# EAGLE design Nova V1.0 (EAGLE 9.6.2)
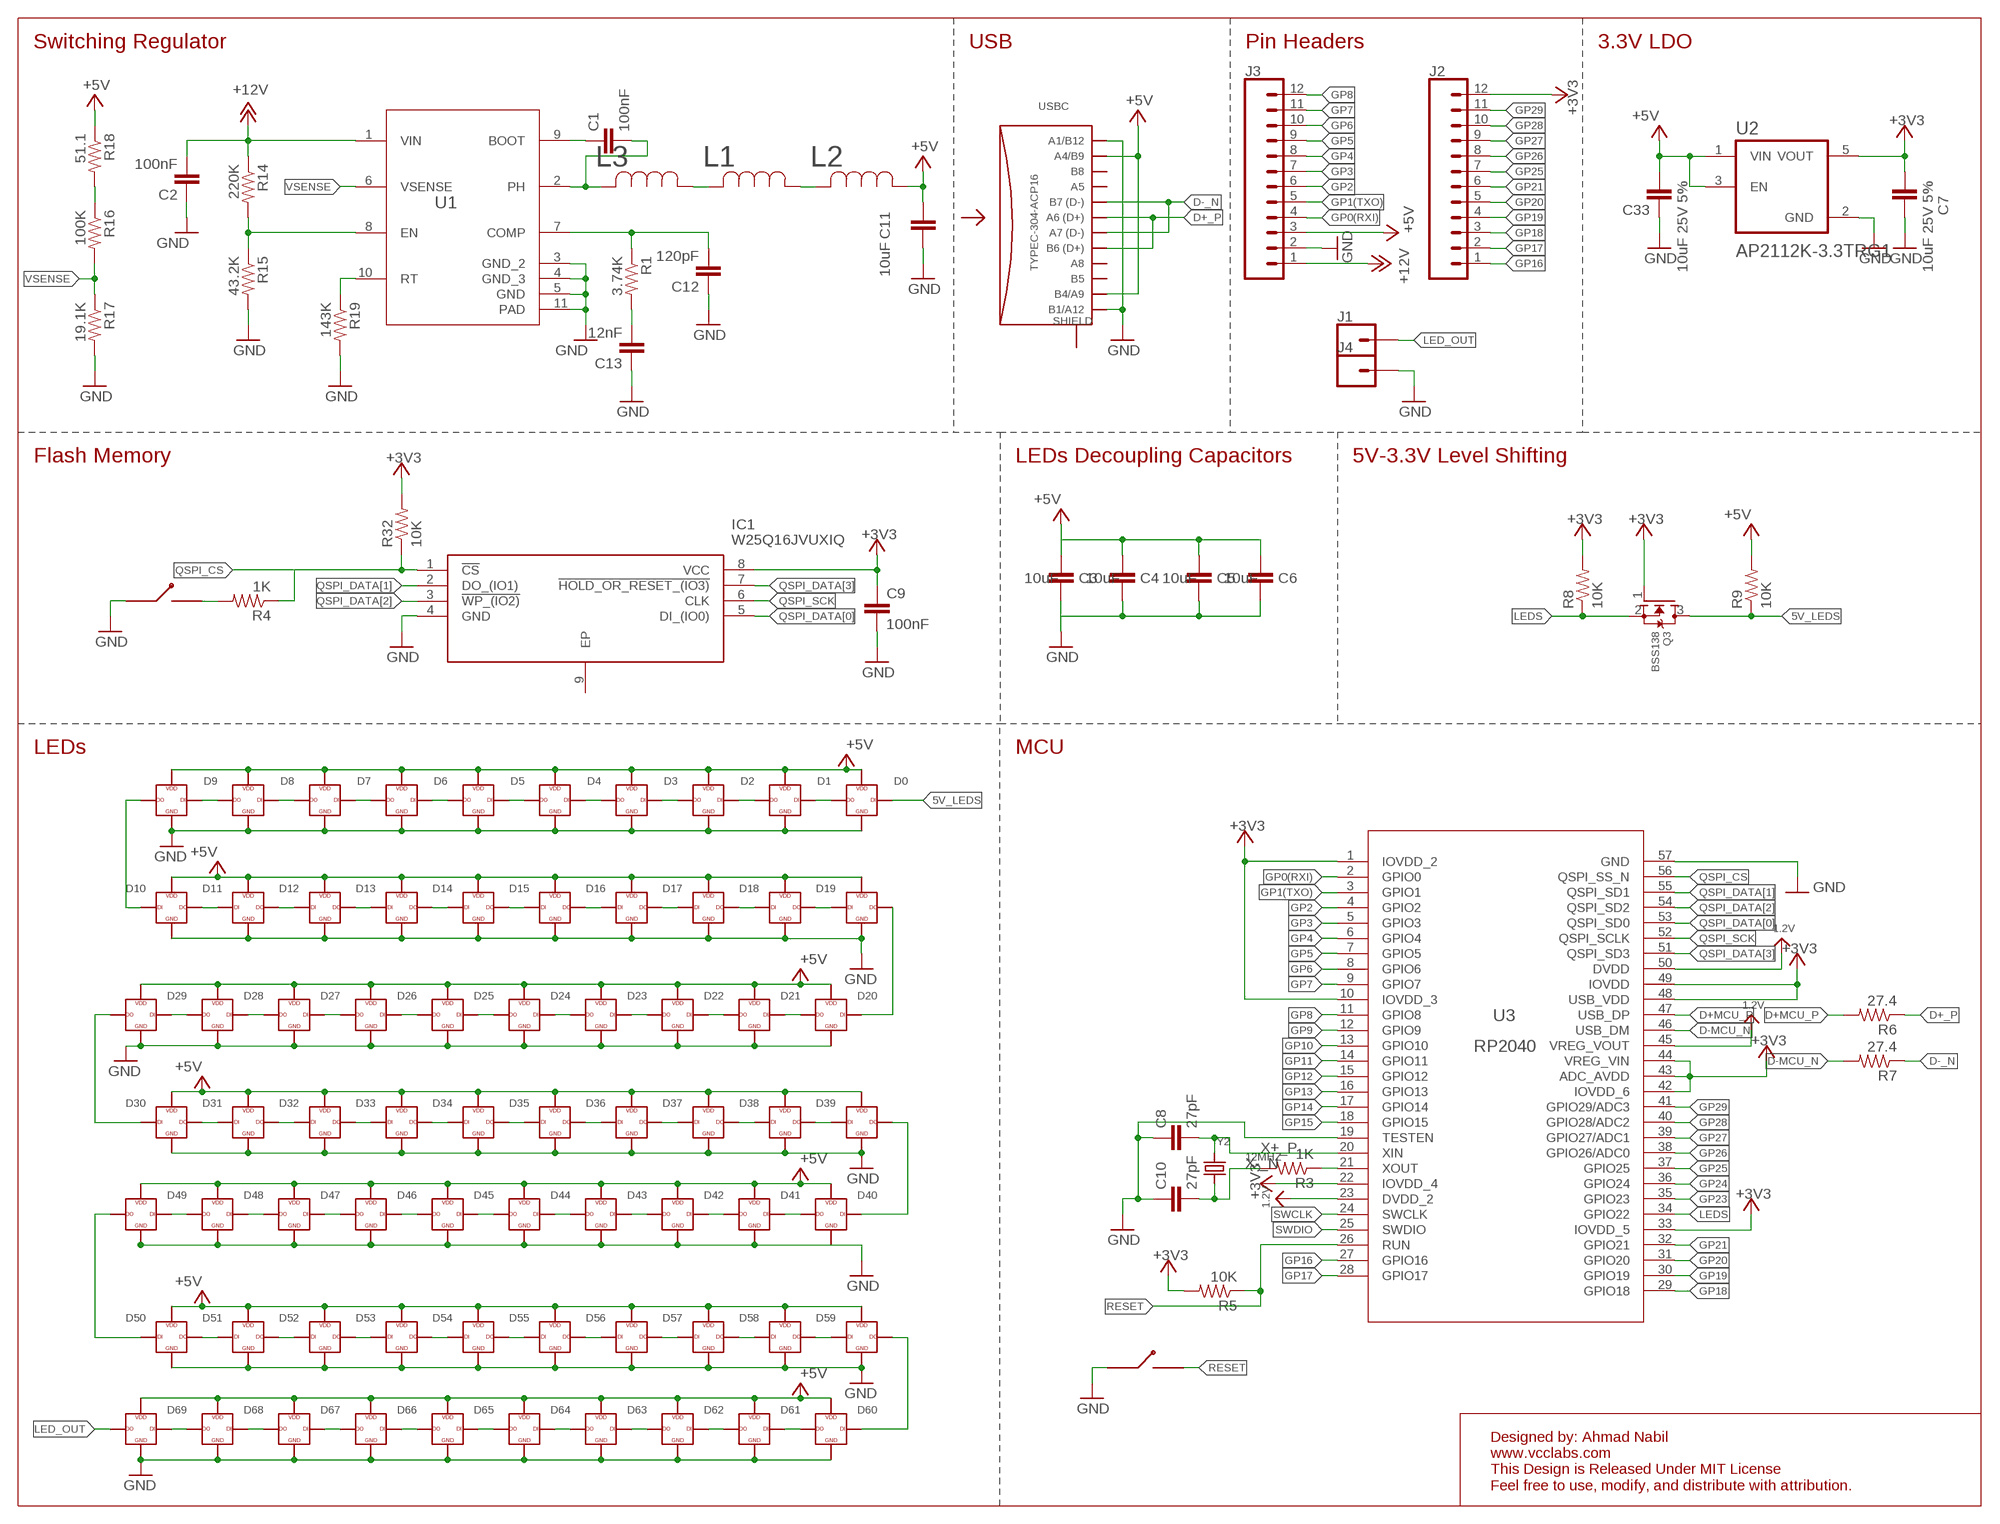
[diagram p0: schematic, sheet 1]

## Parts
C1  100nF  CAP-0402-TIGHT  [0402-TIGHT]
C2  100nF  CAP-0402-TIGHT  [0402-TIGHT]
C3  10uF  C-EUC0603  [C0603]
C4  10uF  C-EUC0603  [C0603]
C5  10uF  C-EUC0603  [C0603]
C6  10uF  C-EUC0603  [C0603]
C7  10uF 25V 5%  C-EUC0603  [C0603]
C8  27pF  CAP-0402-TIGHT  [0402-TIGHT]
C9  100nF  CAP-0402-TIGHT  [0402-TIGHT]
C10  27pF  CAP-0402-TIGHT  [0402-TIGHT]
C11  10uF  C-EUC0603  [C0603]
C12  120pF  CAP-0402-TIGHT  [0402-TIGHT]
C13  12nF  CAP-0402-TIGHT  [0402-TIGHT]
C33  10uF 25V 5%  C-EUC0603  [C0603]
D0  XL-1010RGBC-WS2812B  [XL-1010RGBC-WS2812B]
D1  XL-1010RGBC-WS2812B  [XL-1010RGBC-WS2812B]
D2  XL-1010RGBC-WS2812B  [XL-1010RGBC-WS2812B]
D3  XL-1010RGBC-WS2812B  [XL-1010RGBC-WS2812B]
D4  XL-1010RGBC-WS2812B  [XL-1010RGBC-WS2812B]
D5  XL-1010RGBC-WS2812B  [XL-1010RGBC-WS2812B]
D6  XL-1010RGBC-WS2812B  [XL-1010RGBC-WS2812B]
D7  XL-1010RGBC-WS2812B  [XL-1010RGBC-WS2812B]
D8  XL-1010RGBC-WS2812B  [XL-1010RGBC-WS2812B]
D9  XL-1010RGBC-WS2812B  [XL-1010RGBC-WS2812B]
D10  XL-1010RGBC-WS2812B  [XL-1010RGBC-WS2812B]
D11  XL-1010RGBC-WS2812B  [XL-1010RGBC-WS2812B]
D12  XL-1010RGBC-WS2812B  [XL-1010RGBC-WS2812B]
D13  XL-1010RGBC-WS2812B  [XL-1010RGBC-WS2812B]
D14  XL-1010RGBC-WS2812B  [XL-1010RGBC-WS2812B]
D15  XL-1010RGBC-WS2812B  [XL-1010RGBC-WS2812B]
D16  XL-1010RGBC-WS2812B  [XL-1010RGBC-WS2812B]
D17  XL-1010RGBC-WS2812B  [XL-1010RGBC-WS2812B]
D18  XL-1010RGBC-WS2812B  [XL-1010RGBC-WS2812B]
D19  XL-1010RGBC-WS2812B  [XL-1010RGBC-WS2812B]
D20  XL-1010RGBC-WS2812B  [XL-1010RGBC-WS2812B]
D21  XL-1010RGBC-WS2812B  [XL-1010RGBC-WS2812B]
D22  XL-1010RGBC-WS2812B  [XL-1010RGBC-WS2812B]
D23  XL-1010RGBC-WS2812B  [XL-1010RGBC-WS2812B]
D24  XL-1010RGBC-WS2812B  [XL-1010RGBC-WS2812B]
D25  XL-1010RGBC-WS2812B  [XL-1010RGBC-WS2812B]
D26  XL-1010RGBC-WS2812B  [XL-1010RGBC-WS2812B]
D27  XL-1010RGBC-WS2812B  [XL-1010RGBC-WS2812B]
D28  XL-1010RGBC-WS2812B  [XL-1010RGBC-WS2812B]
D29  XL-1010RGBC-WS2812B  [XL-1010RGBC-WS2812B]
D30  XL-1010RGBC-WS2812B  [XL-1010RGBC-WS2812B]
D31  XL-1010RGBC-WS2812B  [XL-1010RGBC-WS2812B]
D32  XL-1010RGBC-WS2812B  [XL-1010RGBC-WS2812B]
D33  XL-1010RGBC-WS2812B  [XL-1010RGBC-WS2812B]
D34  XL-1010RGBC-WS2812B  [XL-1010RGBC-WS2812B]
D35  XL-1010RGBC-WS2812B  [XL-1010RGBC-WS2812B]
D36  XL-1010RGBC-WS2812B  [XL-1010RGBC-WS2812B]
D37  XL-1010RGBC-WS2812B  [XL-1010RGBC-WS2812B]
D38  XL-1010RGBC-WS2812B  [XL-1010RGBC-WS2812B]
D39  XL-1010RGBC-WS2812B  [XL-1010RGBC-WS2812B]
D40  XL-1010RGBC-WS2812B  [XL-1010RGBC-WS2812B]
D41  XL-1010RGBC-WS2812B  [XL-1010RGBC-WS2812B]
D42  XL-1010RGBC-WS2812B  [XL-1010RGBC-WS2812B]
D43  XL-1010RGBC-WS2812B  [XL-1010RGBC-WS2812B]
D44  XL-1010RGBC-WS2812B  [XL-1010RGBC-WS2812B]
D45  XL-1010RGBC-WS2812B  [XL-1010RGBC-WS2812B]
D46  XL-1010RGBC-WS2812B  [XL-1010RGBC-WS2812B]
D47  XL-1010RGBC-WS2812B  [XL-1010RGBC-WS2812B]
D48  XL-1010RGBC-WS2812B  [XL-1010RGBC-WS2812B]
D49  XL-1010RGBC-WS2812B  [XL-1010RGBC-WS2812B]
D50  XL-1010RGBC-WS2812B  [XL-1010RGBC-WS2812B]
D51  XL-1010RGBC-WS2812B  [XL-1010RGBC-WS2812B]
D52  XL-1010RGBC-WS2812B  [XL-1010RGBC-WS2812B]
D53  XL-1010RGBC-WS2812B  [XL-1010RGBC-WS2812B]
D54  XL-1010RGBC-WS2812B  [XL-1010RGBC-WS2812B]
D55  XL-1010RGBC-WS2812B  [XL-1010RGBC-WS2812B]
D56  XL-1010RGBC-WS2812B  [XL-1010RGBC-WS2812B]
D57  XL-1010RGBC-WS2812B  [XL-1010RGBC-WS2812B]
D58  XL-1010RGBC-WS2812B  [XL-1010RGBC-WS2812B]
D59  XL-1010RGBC-WS2812B  [XL-1010RGBC-WS2812B]
D60  XL-1010RGBC-WS2812B  [XL-1010RGBC-WS2812B]
D61  XL-1010RGBC-WS2812B  [XL-1010RGBC-WS2812B]
D62  XL-1010RGBC-WS2812B  [XL-1010RGBC-WS2812B]
D63  XL-1010RGBC-WS2812B  [XL-1010RGBC-WS2812B]
D64  XL-1010RGBC-WS2812B  [XL-1010RGBC-WS2812B]
D65  XL-1010RGBC-WS2812B  [XL-1010RGBC-WS2812B]
D66  XL-1010RGBC-WS2812B  [XL-1010RGBC-WS2812B]
D67  XL-1010RGBC-WS2812B  [XL-1010RGBC-WS2812B]
D68  XL-1010RGBC-WS2812B  [XL-1010RGBC-WS2812B]
D69  XL-1010RGBC-WS2812B  [XL-1010RGBC-WS2812B]
IC1  W25Q16JVUXIQ  [SON50P300X200X60-9N]
J1  CONN_01  [1X01]
J2  CONN_12  [1X12]
J3  CONN_12  [1X12]
J4  CONN_01  [1X01]
L1  MLP2520S4R7MT0S1IND_2520_TDK-L  [IND_2520_TDK-L]
L2  MLP2520S4R7MT0S1IND_2520_TDK-L  [IND_2520_TDK-L]
L3  MLP2520S4R7MT0S1IND_2520_TDK-L  [IND_2520_TDK-L]
Q3  BSS138  MOSFET-NREFLOW  [SOT23]
R1  3.74K  R-US_R0402  [R0402]
R3  1K  R-US_R0402  [R0402]
R4  1K  R-US_R0402  [R0402]
R5  10K  R-US_R0402  [R0402]
R6  27.4  R-US_R0402  [R0402]
R7  27.4  R-US_R0402  [R0402]
R8  10K  R-US_R0402  [R0402]
R9  10K  R-US_R0402  [R0402]
R14  220K  R-US_R0402  [R0402]
R15  43.2K  R-US_R0402  [R0402]
R16  100K  R-US_R0402  [R0402]
R17  19.1K  R-US_R0402  [R0402]
R18  51.1  R-US_R0402  [R0402]
R19  143K  R-US_R0402  [R0402]
R32  10K  R-US_R0402  [R0402]
S1  B3U-1000P  [B3U-1000P]
S2  B3U-1000P  [B3U-1000P]
U1  TPS54335ADRCRDRC0010J_NV  [DRC0010J_NV]
U2  AP2112K-3.3TRG1  [SOT95P285X140-5N]
U3  RP2040  [IC57_RP2040]
USBC  TYPEC-304-ACP16  [TYPEC-304-ACP16]
Y2  12MHZ  CRYSTAL2.5X2.0  [CRYSTAL_2.5X2]

## Nets
1.2V: U3.23(DVDD_2) U3.45(VREG_VOUT) U3.50(DVDD)
5V_LEDS: D0.4 Q3.3(D) R9.1
+3V3: C7.2 C9.1 IC1.8(VCC) J2.12 Q3.1(G) R5.2 R8.2 R32.2 U2.5(VOUT) U3.1(IOVDD_2) U3.10(IOVDD_3) U3.22(IOVDD_4) U3.33(IOVDD_5) U3.42(IOVDD_6) U3.43(ADC_AVDD) U3.44(VREG_VIN) U3.48(USB_VDD) U3.49(IOVDD)
+5V: C3.1 C4.1 C5.1 C6.1 C11.2 C33.2 D0.2 D1.2 D2.2 D3.2 D4.2 D5.2 D6.2 D7.2 D8.2 D9.2 D10.2 D11.2 D12.2 D13.2 D14.2 D15.2 D16.2 D17.2 D18.2 D19.2 D20.2 D21.2 D22.2 D23.2 D24.2 D25.2 D26.2 D27.2 D28.2 D29.2 D30.2 D31.2 D32.2 D33.2 D34.2 D35.2 D36.2 D37.2 D38.2 D39.2 D40.2 D41.2 D42.2 D43.2 D44.2 D45.2 D46.2 D47.2 D48.2 D49.2 D50.2 D51.2 D52.2 D53.2 D54.2 D55.2 D56.2 D57.2 D58.2 D59.2 D60.2 D61.2 D62.2 D63.2 D64.2 D65.2 D66.2 D67.2 D68.2 D69.2 J3.3 L2.1 R9.2 R18.1 U2.1(VIN) U2.3(EN) USBC.A4/B9 USBC.B4/A9
+12V [power]: C2.2 J3.1 R14.1 U1.1(VIN)
D+_P: R6.1 USBC.A6 USBC.B6
D+MCU_P: R6.2 U3.47(USB_DP)
D-_N: R7.1 USBC.A7 USBC.B7
D-MCU_N: R7.2 U3.46(USB_DM)
GND: C2.1 C3.2 C4.2 C5.2 C6.2 C7.1 C8.1 C9.2 C10.1 C11.1 C12.1 C13.1 C33.1 D0.3 D1.3 D2.3 D3.3 D4.3 D5.3 D6.3 D7.3 D8.3 D9.3 D10.3 D11.3 D12.3 D13.3 D14.3 D15.3 D16.3 D17.3 D18.3 D19.3 D20.3 D21.3 D22.3 D23.3 D24.3 D25.3 D26.3 D27.3 D28.3 D29.3 D30.3 D31.3 D32.3 D33.3 D34.3 D35.3 D36.3 D37.3 D38.3 D39.3 D40.3 D41.3 D42.3 D43.3 D44.3 D45.3 D46.3 D47.3 D48.3 D49.3 D50.3 D51.3 D52.3 D53.3 D54.3 D55.3 D56.3 D57.3 D58.3 D59.3 D60.3 D61.3 D62.3 D63.3 D64.3 D65.3 D66.3 D67.3 D68.3 D69.3 IC1.4(GND) J3.2 J4.1 R15.2 R17.2 R19.2 S1.1 S2.1 U1.3(GND_2) U1.4(GND_3) U1.5(GND) U1.11(PAD) U2.2(GND) U3.19(TESTEN) U3.57(GND) USBC.A1/B12 USBC.B1/A12
GP0(RXI): J3.4 U3.2(GPIO0)
GP1(TXO): J3.5 U3.3(GPIO1)
GP2: J3.6 U3.4(GPIO2)
GP3: J3.7 U3.5(GPIO3)
GP4: J3.8 U3.6(GPIO4)
GP5: J3.9 U3.7(GPIO5)
GP6: J3.10 U3.8(GPIO6)
GP7: J3.11 U3.9(GPIO7)
GP8: J3.12 U3.11(GPIO8)
GP9: U3.12(GPIO9)
GP10: U3.13(GPIO10)
GP11: U3.14(GPIO11)
GP12: U3.15(GPIO12)
GP13: U3.16(GPIO13)
GP14: U3.17(GPIO14)
GP15: U3.18(GPIO15)
GP16: J2.1 U3.27(GPIO16)
GP17: J2.2 U3.28(GPIO17)
GP18: J2.3 U3.29(GPIO18)
GP19: J2.4 U3.30(GPIO19)
GP20: J2.5 U3.31(GPIO20)
GP21: J2.6 U3.32(GPIO21)
GP23: U3.35(GPIO23)
GP24: U3.36(GPIO24)
GP25: J2.7 U3.37(GPIO25)
GP26: J2.8 U3.38(GPIO26/ADC0)
GP27: J2.9 U3.39(GPIO27/ADC1)
GP28: J2.10 U3.40(GPIO28/ADC2)
GP29: J2.11 U3.41(GPIO29/ADC3)
LED_OUT: D69.1 J1.1
LEDS: Q3.2(S) R8.1 U3.34(GPIO22)
N$1: D0.1 D1.4
N$2: D1.1 D2.4
N$3: D2.1 D3.4
N$4: D3.1 D4.4
N$5: D4.1 D5.4
N$6: D5.1 D6.4
N$7: D6.1 D7.4
N$8: D7.1 D8.4
N$9: D8.1 D9.4
N$10: D9.1 D10.4
N$11: D10.1 D11.4
N$12: D11.1 D12.4
N$13: D12.1 D13.4
N$14: D13.1 D14.4
N$15: D14.1 D15.4
N$16: D15.1 D16.4
N$17: D16.1 D17.4
N$18: D17.1 D18.4
N$19: D18.1 D19.4
N$20: D19.1 D20.4
N$21: D20.1 D21.4
N$22: D21.1 D22.4
N$23: D22.1 D23.4
N$24: D23.1 D24.4
N$25: D24.1 D25.4
N$26: D25.1 D26.4
N$27: D26.1 D27.4
N$28: D27.1 D28.4
N$29: D28.1 D29.4
N$30: D29.1 D30.4
N$31: D30.1 D31.4
N$32: D31.1 D32.4
N$33: D32.1 D33.4
N$34: D33.1 D34.4
N$35: D34.1 D35.4
N$36: D35.1 D36.4
N$37: D36.1 D37.4
N$38: D37.1 D38.4
N$39: D38.1 D39.4
N$40: D39.1 D40.4
N$41: D40.1 D41.4
N$42: D41.1 D42.4
N$43: D42.1 D43.4
N$44: D43.1 D44.4
N$45: D44.1 D45.4
N$46: D45.1 D46.4
N$47: D46.1 D47.4
N$48: D47.1 D48.4
N$49: D48.1 D49.4
N$50: D49.1 D50.4
N$51: D50.1 D51.4
N$52: D51.1 D52.4
N$53: D52.1 D53.4
N$54: D53.1 D54.4
N$55: D54.1 D55.4
N$56: D55.1 D56.4
N$57: D56.1 D57.4
N$58: D57.1 D58.4
N$59: D58.1 D59.4
N$60: D59.1 D60.4
N$61: D60.1 D61.4
N$62: D61.1 D62.4
N$63: D62.1 D63.4
N$64: D63.1 D64.4
N$65: D64.1 D65.4
N$66: D65.1 D66.4
N$67: D66.1 D67.4
N$68: D67.1 D68.4
N$69: D68.1 D69.4
N$70: R3.1 U3.21(XOUT)
N$71: R4.2 S1.2
N$79: C1.1 U1.9(BOOT)
N$80 [power]: L1.2 L3.1
N$81 [power]: L1.1 L2.2
N$82: C13.2 R1.2
N$83: C12.2 R1.1 U1.7(COMP)
N$84: R14.2 R15.1 U1.8(EN)
N$85: R16.1 R18.2
N$86: R19.1 U1.10(RT)
PH [power]: C1.2 L3.2 U1.2(PH)
QSPI_CS: IC1.1(!CS) R4.1 R32.1 U3.56(QSPI_SS_N)
QSPI_DATA[0]: IC1.5(DI_(IO0)) U3.53(QSPI_SD0)
QSPI_DATA[1]: IC1.2(DO_(IO1)) U3.55(QSPI_SD1)
QSPI_DATA[2]: IC1.3(!WP_(IO2)) U3.54(QSPI_SD2)
QSPI_DATA[3]: IC1.7(!HOLD_OR_RESET_(IO3)) U3.51(QSPI_SD3)
QSPI_SCK: IC1.6(CLK) U3.52(QSPI_SCLK)
RESET: R5.1 S2.2 U3.26(RUN)
SWCLK: U3.24(SWCLK)
SWDIO: U3.25(SWDIO)
VSENSE: R16.2 R17.1 U1.6(VSENSE)
X+_P: C8.2 U3.20(XIN) Y2.3
X-_N: C10.2 R3.2 Y2.1
Unconnected: IC1.9(EP) USBC.1(SHIELD) USBC.2(SHIELD) USBC.3(SHIELD) USBC.4(SHIELD) USBC.A5 USBC.A8 USBC.B5 USBC.B8

## Notes on the sheet
- Switching Regulator | USB | Pin Headers | 3.3V LDO
- Flash Memory | LEDs Decoupling Capacitors | 5V-3.3V Level Shifting
- LEDs | MCU
- Designed by: Ahmad Nabil
  www.vcclabs.com
  This Design is Released Under MIT License
  Feel free to use, modify, and distribute with attribution.

## Library data of the parts
C1 C2 C8-C10 C12 C13 = SparkFun-Capacitors:CAP
C3-C7 C11 C33 = rcl:C-EU: CAPACITOR, European symbol; SPICEPREFIX: C
D0 D1-D69 = XL-1010RGBC-WS2812B:XL-1010RGBC-WS2812B
IC1 = W25Q16JVUXIQ:W25Q16JVUXIQ: SPIFLASH, 3V, 16M-BIT, 4KB UNIFO Source: Datasheet <https://www.winbond.com/resource-files/w25q16jv spi revh 04082019 plus.pdf> Check availability <https://pricing.snapeda.com/parts/W25Q16JVUXIQ/Winbond/view-part?ref=eda>; AVAILABILITY: Not in stock; CHECK_PRICES: https://www.snapeda.com/parts/W25Q16JVUXIQ/Winbond/view-part/?ref=eda; DESCRIPTION: NOR Flash Serial (SPI, Dual SPI, Quad SPI) 3V/3.3V 16M-bit 2M x 8 6ns 8-Pin USON EP T/R; MF: Winbond; MP: W25Q16JVUXIQ; PACKAGE: UFDFN-8 Winbond; PRICE: None; PURCHASE-URL: https://www.snapeda.com/api/url_track_click_mouser/?unipart_id=2780688&manufacturer=Winbond&part_name=W25Q16JVUXIQ&search_term=None; SNAPEDA_LINK: https://www.snapeda.com/parts/W25Q16JVUXIQ/Winbond/view-part/?ref=snap
J1 J4 = SparkFun-Connectors:CONN_01: Single connection point. Often used as Generic Header-pin footprint for 0.1 inch spaced/style header connections On any of the 0.1 inch spaced packages, you can populate with these: Break Away Headers - Straight <https://www.sparkfun.com/products/116> (PRT-00116) Break Away Male Headers - Right Angle <https://www.sparkfun.com/products/553> (PRT-00553) Female Headers <https://www.sparkfun.com/products/115> (PRT-00115) Break Away Headers - Machine Pin <https://www.sparkfun.com/products/117> (PRT-00117) Break Away Female Headers - Swiss Machine Pin <https://www.sparkfun.com/products/743> (PRT-00743) This device is also useful as a general connection point to wire up your design to another part of your project. Our various solder wires solder well into these plated through hole pads. Hook-Up Wire - Assortment (Stranded, 22 AWG) <https://www.sparkfun.com/products/11375> (PRT-11375) Hook-Up Wire - Assortment (Solid Core, 22 AWG) <https://www.sparkfun.com/products/11367> (PRT-11367) View the entire wire category on our website here <https://www.sparkfun.com/categories/141> Special notes: SMTSO-256-ET is a "flush mount" nut for a 4-40 screw. We mostly use this on specialty testbeds; it is a nice way to connect hardware to your PCB at an adjustable hieght. Also note, the SNAP packages are for using a snappable style connector. We sell a baggie of snaps and they are also used on two LilyPad designs: Snap Assortment - 30 pack (male and female) <https://www.sparkfun.com/products/11347> (DEV-11347) LilyPad Arduino SimpleSnap <https://www.sparkfun.com/products/10941> (DEV-10941) LilyPad SimpleSnap Protoboard <https://www.sparkfun.com/products/10940> (DEV-10940)
J2 J3 = SparkFun-Connectors:CONN_12: Multi connection point. Often used as Generic Header-pin footprint for 0.1 inch spaced/style header connections On any of the 0.1 inch spaced packages, you can populate with these: Break Away Headers - Straight <https://www.sparkfun.com/products/116> (PRT-00116) Break Away Male Headers - Right Angle <https://www.sparkfun.com/products/553> (PRT-00553) Female Headers <https://www.sparkfun.com/products/115> (PRT-00115) Break Away Headers - Machine Pin <https://www.sparkfun.com/products/117> (PRT-00117) Break Away Female Headers - Swiss Machine Pin <https://www.sparkfun.com/products/743> (PRT-00743) For SCREWTERMINALS and SPRING TERMINALS visit here: Screw Terimnals on SparkFun.com <https://www.sparkfun.com/search/results?term=Screw+Terminals> (5mm/3.5mm/2.54mm spacing) This device is also useful as a general connection point to wire up your design to another part of your project. Our various solder wires solder well into these plated through hole pads. Hook-Up Wire - Assortment (Stranded, 22 AWG) <https://www.sparkfun.com/products/11375> (PRT-11375) Hook-Up Wire - Assortment (Solid Core, 22 AWG) <https://www.sparkfun.com/products/11367> (PRT-11367) View the entire wire category on our website here <https://www.sparkfun.com/categories/141> Special notes: Molex polarized connector foot print use with SKU : PRT-08231 with associated crimp pins and housings. 1MM SMD Version SKU: PRT-10208 NOTES ON THE VARIANTS LOCK and LOCK_LONGPADS... This footprint was designed to help hold the alignment of a through-hole component (i.e. 6-pin header) while soldering it into place. You may notice that each hole has been shifted either up or down by 0.005 of an inch from it's more standard position (which is a perfectly straight line). This slight alteration caused the pins (the squares in the middle) to touch the edges of the holes. Because they are alternating, it causes a "brace" to hold the component in place. 0.005 has proven to be the perfect amount of "off-center" position when using our standard breakaway headers. Although looks a little odd when you look at the bare footprint, once you have a header in there, the alteration is very hard to notice. Also,if you push a header all the way into place, it is covered up entirely on the bottom side.
L1-L3 = MLP2520S4R7MT0S1:MLP2520S4R7MT0S1; COPYRIGHT: Copyright (C) 2022 Ultra Librarian. All rights reserved.; MANUFACTURER_PART_NUMBER: MLP2520S4R7MT0S1; MFR_NAME: TDK
Q3 = adafruit:MOSFET-N: N-Channel Mosfet 2N7002E - 60V 260mA SOT23 [Digikey: 2N7002ET1GOSTR-ND] - REEL BSH103 - 30V 850mA SOT23 [Digikey: 568-5013-1-ND]
R1 R3-R9 R14-R19 R32 = rcl:R-US_: RESISTOR, American symbol; SPICEPREFIX: R
S1 S2 = B3U-1000P:B3U-1000P
U1 = TPS54335ADRCR:TPS54335ADRCR; COPYRIGHT: Copyright (C) 2024 Ultra Librarian. All rights reserved.; MANUFACTURER_PART_NUMBER: TPS54335ADRCR; MFR_NAME: Texas Instruments; REFDES: RefDes; TYPE: TYPE
U2 = AP2112K-3.3TRG1:AP2112K-3.3TRG1: AP2112 Series 0.6 A 3.3 V Fixed Output SMT LDO Linear Regulator - SOT23-5 Check availability <https://pricing.snapeda.com/parts/AP2112K-3.3TRG1/Diodes%20Inc./view-part?ref=eda>; AVAILABILITY: In Stock; CHECK_PRICES: https://www.snapeda.com/parts/AP2112K-3.3TRG1/Diodes+Inc./view-part/?ref=eda; DESCRIPTION: Voltage Regulators, LDO, 600mA CMOS LDO 50mA 3.3V 250mV | Diodes Inc AP2112K-3.3TRG1; MF: Diodes Inc.; MP: AP2112K-3.3TRG1; PACKAGE: SOT-753 Diodes Inc.; PRICE: None; PURCHASE-URL: https://www.snapeda.com/api/url_track_click_mouser/?unipart_id=454988&manufacturer=Diodes Inc.&part_name=AP2112K-3.3TRG1&search_term=None; SNAPEDA_LINK: https://www.snapeda.com/parts/AP2112K-3.3TRG1/Diodes+Inc./view-part/?ref=snap
U3 = RP2040:RP2040; COPYRIGHT: Copyright (C) 2022 Ultra Librarian. All rights reserved.; MANUFACTURER_PART_NUMBER: RP2040; MFR_NAME: Raspberry Pi
USBC = TYPEC-304-ACP16:TYPEC-304-ACP16
Y2 = microbuilder:CRYSTAL: Crystals HC49UP - Surface Mount Crystal 4.0MHz 18pF +/-30ppm Surface Mount Crystal [Digikey: 535-9857-1-ND] 12.0 MHz Surface Mount Crystal [Digikey: 535-9869-6-ND] 25.0 MHz Surface Mount Crystal [Digikey: 535-9078-1-ND] 2.5 x 2.0mm - MEMs SMT Crystal 16.0 MHz 10pF 20ppm 2.5 x 2.0mm Crystal [Digikey -40-85°C: 535-10923-1-ND] 3.2 x 2.5mm - MEMs SMT Crystal 12.0 MHz 8pF 15ppm 3.2 x 2.5mm Crystal [Digikey: -10-70°C: 644-1047-1-ND -40-125°C: 644-1128-1-ND] 40~85°C cheaper: 644-1173-6-ND 16.0 MHz 8pF 15ppm 3.2 x 2.5mm Crystal [Digikey: -10-70°C: 644-1049-1-ND -40-125°C: 644-1129-2-ND]-40~85°C cheaper: 644-1175-6-ND 16.0 MHz 10pF 10ppm 3.2 x 2.5mm Crystal [Digikey: 644-1100-1-ND] 27.12 MHz 18pF 30ppm 3.2 x 2.5mm Crystal [Digikey: 887-1424-1-ND] 27.12MHz 10pF 10ppm 3.2 x 2.5mm Crystal [Digikey: 887-1329-1-ND] 4.9 x 1.8mm - MEMs SMT Crystal 32.768 KHz 12.5pF 20ppm 4.9 x 1.8mm Crystal [Digikey: SE2415CT-ND] 8.0 x 3.8mm - Surface Mount Crystal 32.768kHz 12.5pF 20ppm -40°C-85°C [Digikey: 535-9166-2-ND] Cylinder 32.768KHz Cylinder Crystal (2x6mm body) [Ex. Digikey: 300-8341-2-ND]

## Net classes
0 default: width 0.152 mm, drill 0.15 mm, clearance 0.152 mm
1 power: width 0.406 mm, clearance 0.152 mm
3 +5V: width 0.406 mm, clearance 0.152 mm
4 +3.3V: width 0.195 mm, clearance 0.152 mm
5 GND: width 0.406 mm, clearance 0.152 mm

## Board
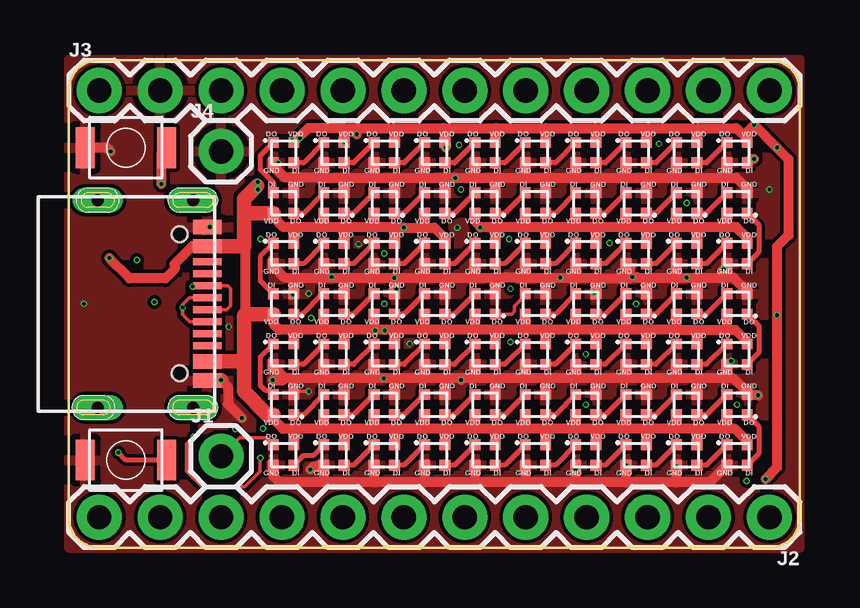
[diagram p1: board, top side]
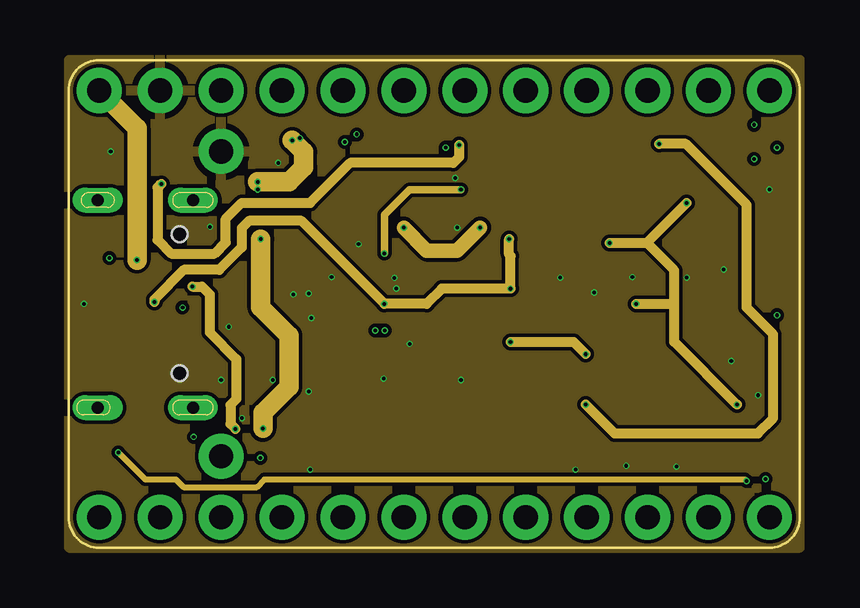
[diagram p2: board, inner layer Route2]
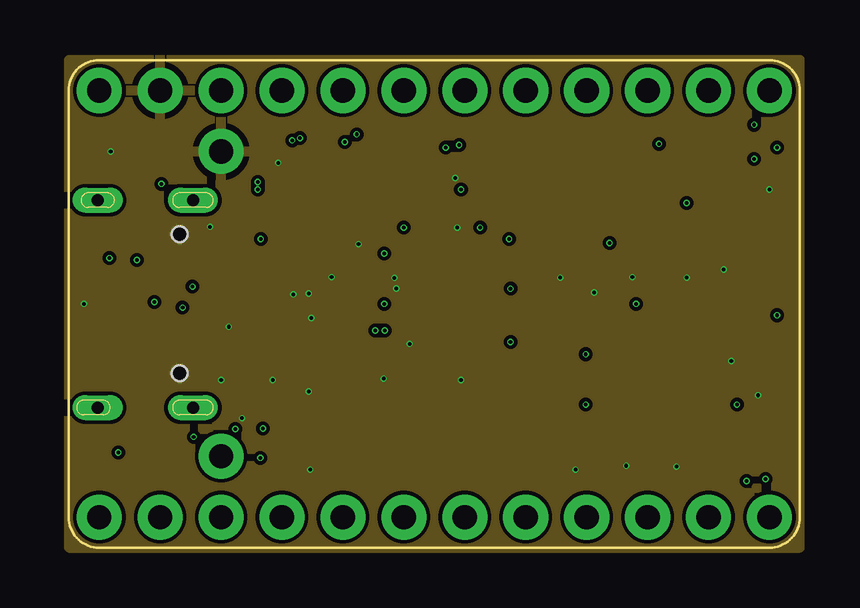
[diagram p3: board, inner layer Route15]
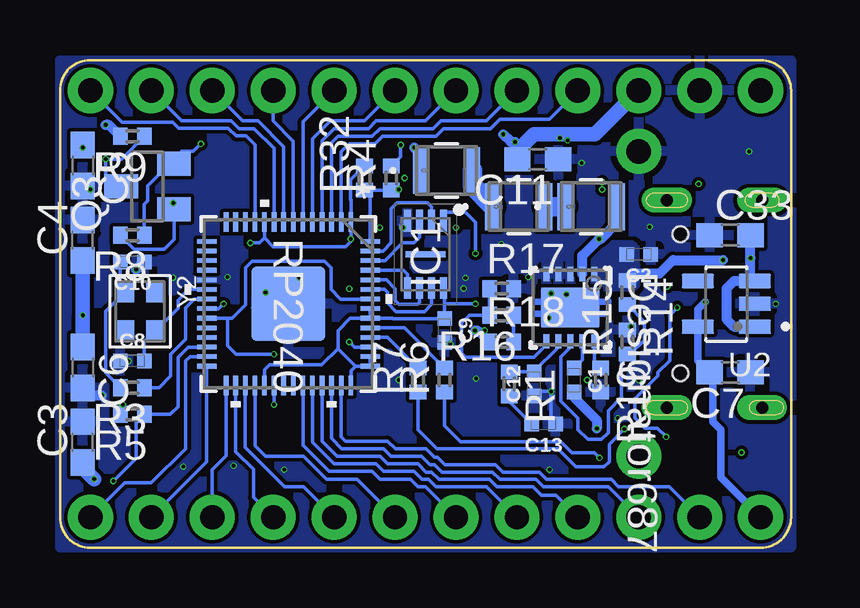
[diagram p4: board, bottom side, seen from below]

Size 30.48 x 20.32 mm. Coordinates in mm from the lower left corner, seen from the top.
Outline: 0,1.27 0,19.05 arc-90 1.27,20.32 29.21,20.32 arc-90 30.48,19.05 30.48,1.27 arc-90 29.21,0 1.27,0 arc-90 0,1.27
Copper layers (1+2*15+16): Top 0.035mm / dielectric 1.5mm / Route2 0.035mm / dielectric 0.15mm / Route15 0.035mm / dielectric 0.2mm / Bottom 0.035mm
Design rules "default *": minimum track width 0.003225mm, minimum drill 0.15mm, track to track 5mil, track to pad 5mil, pad to pad 6mil, via to via 6mil, smd to smd 0mil, copper to edge 0mil, drill to drill 6mil, minimum pad ring 0.05mm, minimum via ring 0.05mm, stop-mask expansion 0mil, vias tented up to drill 20mil, thermal gap 10mil

### Footprints (pad centres in the part's own frame; a part is rotated, then mirrored left to right if it is on the bottom)
0402-TIGHT = smd 0.6 x 0.6: 1 -0.5,0; 2 0.5,0
C0603 = smd 1.1 x 1: 1 -0.85,0; 2 0.85,0
XL-1010RGBC-WS2812B = smd 0.45 x 0.45: 1 -0.425,0.425; 2 0.425,0.425; 3 -0.425,-0.425; 4 0.425,-0.425
SON50P300X200X60-9N = smd 0.9 x 0.3: 1 -1.4,0.75; 2 -1.4,0.25; 3 -1.4,-0.25; 4 -1.4,-0.75; 5 1.4,-0.75; 6 1.4,-0.25; 7 1.4,0.25; 8 1.4,0.75 | smd 0.25 x 1.65: 9 0,0
1X01 = drill 1.016 pad 1.88: 1 0,0
1X12 = drill 1.016 pad 1.88: 1 0,0; 2 2.54,0; 3 5.08,0; 4 7.62,0; 5 10.16,0; 6 12.7,0; 7 15.24,0; 8 17.78,0; 9 20.32,0; 10 22.86,0; 11 25.4,0; 12 27.94,0
IND_2520_TDK-L = smd 0.652 x 1.949: 1 -1.076,0; 2 1.076,0
SOT23 = smd 1 x 1.4: 1 -0.95,-1.1; 2 0.95,-1.1; 3 0,1.1
R0402 = smd 0.6 x 0.7: 1 -0.5,0; 2 0.5,0
B3U-1000P = smd 0.8 x 1.7: 1 1.7,0; 2 -1.7,0
DRC0010J_NV = smd 0.6 x 0.25: 1 -1.4,1; 2 -1.4,0.5; 3 -1.4,0; 4 -1.4,-0.5; 5 -1.4,-1; 6 1.4,-1; 7 1.4,-0.5; 8 1.4,0; 9 1.4,0.5; 10 1.4,1 | smd 1.65 x 2.4: 11 0,0
SOT95P285X140-5N = smd 1.35 x 0.6: 1 -1.185,0.95; 2 -1.185,0; 3 -1.185,-0.95; 4 1.185,-0.95; 5 1.185,0.95
IC57_RP2040 = smd 0.813 x 0.195: 1 -3.404,2.6; 2 -3.404,2.2; 3 -3.404,1.8; 4 -3.404,1.4; 5 -3.404,1; 6 -3.404,0.6; 7 -3.404,0.2; 8 -3.404,-0.2; 9 -3.404,-0.6; 10 -3.404,-1; 11 -3.404,-1.4; 12 -3.404,-1.8; 13 -3.404,-2.2; 14 -3.404,-2.6; 29 3.404,-2.6; 30 3.404,-2.2; 31 3.404,-1.8; 32 3.404,-1.4; 33 3.404,-1; 34 3.404,-0.6; 35 3.404,-0.2; 36 3.404,0.2; 37 3.404,0.6; 38 3.404,1; 39 3.404,1.4; 40 3.404,1.8; 41 3.404,2.2; 42 3.404,2.6 | smd 0.195 x 0.813: 15 -2.6,-3.404; 16 -2.2,-3.404; 17 -1.8,-3.404; 18 -1.4,-3.404; 19 -1,-3.404; 20 -0.6,-3.404; 21 -0.2,-3.404; 22 0.2,-3.404; 23 0.6,-3.404; 24 1,-3.404; 25 1.4,-3.404; 26 1.8,-3.404; 27 2.2,-3.404; 28 2.6,-3.404; 43 2.6,3.404; 44 2.2,3.404; 45 1.8,3.404; 46 1.4,3.404; 47 1,3.404; 48 0.6,3.404; 49 0.2,3.404; 50 -0.2,3.404; 51 -0.6,3.404; 52 -1,3.404; 53 -1.4,3.404; 54 -1.8,3.404; 55 -2.2,3.404; 56 -2.6,3.404 | smd 3.1 x 3.1: 57 0,0
TYPEC-304-ACP16 = drill 0.5 pad 1.05 long: 1 -4.32,2.775; 2 -4.32,-1.193; 3 4.32,-1.193; 4 4.32,2.775 | smd 0.6 x 1.2: A1/B12 -3.2,3.375; A4/B9 -2.4,3.375; B1/A12 3.2,3.375; B4/A9 2.4,3.375 | smd 0.3 x 1.2: A5 -1.25,3.375; A6 -0.25,3.375; A7 0.25,3.375; A8 1.25,3.375; B5 1.75,3.375; B6 0.75,3.375; B7 -0.75,3.375; B8 -1.75,3.375 | hole 0.65: -2.89,2.225; 2.89,2.225
CRYSTAL_2.5X2 = smd 0.9 x 0.75: 1 -0.825,-0.625; 2 0.825,-0.625; 3 0.825,0.625; 4 -0.825,0.625

### Placement (x,y rotation side)
C1  9.05,6.99 270 bottom
C2  6.35,12.22 180 bottom
C3  29.53,4.4 90 bottom
C4  29.53,12.81 90 bottom
C5  29.53,15.92 270 bottom
C6  29.53,7.51 270 bottom
C7  2.54,7.3 180 bottom
C8  27.46,7.78 0 bottom
C9  14.45,9.05 270 bottom
C10  27.46,11.91 180 bottom
C11  10.56,16.19 180 bottom
C12  10.72,6.83 90 bottom
C13  10.32,5.16 180 bottom
C33  2.54,13.02 0 bottom
D0  27.86,16.46 0 top
D1  25.76,16.46 0 top
D2  23.66,16.46 0 top
D3  21.56,16.46 0 top
D4  19.46,16.46 0 top
D5  17.36,16.46 0 top
D6  15.26,16.46 0 top
D7  13.16,16.46 0 top
D8  11.06,16.46 0 top
D9  8.96,16.46 0 top
D10  8.96,14.36 180 top
D11  11.06,14.36 180 top
D12  13.16,14.36 180 top
D13  15.26,14.36 180 top
D14  17.36,14.36 180 top
D15  19.46,14.36 180 top
D16  21.56,14.36 180 top
D17  23.66,14.36 180 top
D18  25.76,14.36 180 top
D19  27.86,14.36 180 top
D20  27.86,12.26 0 top
D21  25.76,12.26 0 top
D22  23.66,12.26 0 top
D23  21.56,12.26 0 top
D24  19.46,12.26 0 top
D25  17.36,12.26 0 top
D26  15.26,12.26 0 top
D27  13.16,12.26 0 top
D28  11.06,12.26 0 top
D29  8.96,12.26 0 top
D30  8.96,10.16 180 top
D31  11.06,10.16 180 top
D32  13.16,10.16 180 top
D33  15.26,10.16 180 top
D34  17.36,10.16 180 top
D35  19.46,10.16 180 top
D36  21.56,10.16 180 top
D37  23.66,10.16 180 top
D38  25.76,10.16 180 top
D39  27.86,10.16 180 top
D40  27.86,8.06 0 top
D41  25.76,8.06 0 top
D42  23.66,8.06 0 top
D43  21.56,8.06 0 top
D44  19.46,8.06 0 top
D45  17.36,8.06 0 top
D46  15.26,8.06 0 top
D47  13.16,8.06 0 top
D48  11.06,8.06 0 top
D49  8.96,8.06 0 top
D50  8.96,5.96 180 top
D51  11.06,5.96 180 top
D52  13.16,5.96 180 top
D53  15.26,5.96 180 top
D54  17.36,5.96 180 top
D55  19.46,5.96 180 top
D56  21.56,5.96 180 top
D57  23.66,5.96 180 top
D58  25.76,5.96 180 top
D59  27.86,5.96 180 top
D60  27.86,3.86 0 top
D61  25.76,3.86 0 top
D62  23.66,3.86 0 top
D63  21.56,3.86 0 top
D64  19.46,3.86 0 top
D65  17.36,3.86 0 top
D66  15.26,3.86 0 top
D67  13.16,3.86 0 top
D68  11.06,3.86 0 top
D69  8.96,3.86 0 top
IC1  15.24,12.22 270 bottom
J1  6.35,3.81 0 top
J2  29.21,1.27 180 top
J3  1.27,19.05 0 top
J4  6.35,16.51 0 top
L1  11.35,14.21 0 bottom
L2  14.37,15.72 0 bottom
L3  8.33,14.21 0 bottom
Q3  26.83,15.05 90 bottom
R1  11.75,6.83 270 bottom
R3  27.46,6.67 180 bottom
R4  16.67,15.4 90 bottom
R5  27.46,5.56 180 bottom
R6  14.45,6.99 90 bottom
R7  15.56,6.99 90 bottom
R8  27.46,13.02 180 bottom
R9  27.46,17.14 180 bottom
R14  6.83,10.64 270 bottom
R15  6.83,8.57 90 bottom
R16  12.06,9.68 180 bottom
R17  12.06,10.79 0 bottom
R18  12.06,8.57 0 bottom
R19  7.94,6.99 270 bottom
R32  17.78,15.4 90 bottom
S1  2.38,16.67 180 top
S2  2.38,3.65 180 top
U1  9.21,10 270 bottom
U2  2.7,10.16 180 bottom
U3  20.95,10.16 270 bottom
USBC  2.4,10.16 270 top
Y2  27.15,9.84 270 bottom

### Tracks (layer width: path | path; a pad name or v marks a point on that pad's centre or on a via)
1.2V  (via drill 0.15 pad 0.26)
  Route2 0.406: v21.56,8.06 21.04,8.57 v18.41,8.57
  Bottom 0.152: U3.50 18.77,10.36 19.18,10.76 19.18,11.67 19.45,11.94 22.46,11.94 22.73,11.67 22.73,10.13 23.3,9.56 23.5,9.56 | 23.5,9.56 U3.23 | U3.45 18.2,8.36 v18.41,8.57 | 23.5,9.56 23.5,8.41 23.14,8.06 v21.56,8.06
5V_LEDS  (via drill 0.15 pad 0.26)
  Top 0.406: D0.4 28.44,16.19 v28.57,16.19
  Bottom 0.152: R9.1 27.92,16.19 v28.57,16.19 28.57,15.24 28.38,15.05 Q3.3
+3V3  (via drill 0.15 pad 0.26)
  Route2 0.406: v18.36,12.86 18.36,12.22 18.41,12.16 v18.41,10.79 15.55,10.79 14.92,10.16 v13.16,10.16 9.7,13.62 7.51,13.62 7.21,13.32 7.21,12.51 6.27,11.57 4.79,11.57 3.57,10.35 v3.57,10.24 | v22.54,12.7 24.1,12.7 | 24.1,12.7 v25.76,14.36 | v27.86,5.96 25.24,8.57 25.24,10.16 | 24.1,12.7 25.24,11.55 25.24,10.16 | v23.66,10.16 25.24,10.16
  Bottom 0.152: 3.6,7.51 C7.2 | IC1.8 14.45,10.78 14.45,10.16 | 14.45,10.16 C9.1 15.15,9.55 15.16,9.54 16.59,9.54 16.61,9.56 U3.48 | 18.16,7.56 U3.43 U3.44 | U3.42 18.36,7.36 18.16,7.56 | R8.2 27.38,12.44 26.14,12.44 25.73,12.85 Q3.1 | 21.95,12.91 U3.10 | 21.95,12.91 21.59,12.54 18.57,12.54 18.36,12.76 v18.36,12.86 U3.1 18.36,14.5 18.36,15.32 R32.2 | U3.48 U3.49 | 21.95,12.91 22.16,12.7 v22.54,12.7 | R5.2 27.86,5.66 v27.86,5.96 | 18.89,8.29 18.89,9.05 18.38,9.56 U3.48 | 18.16,7.56 18.89,8.29 | 18.89,8.29 19.57,7.62 21.75,7.62 21.95,7.41 U3.33 | v13.16,10.16 14.45,10.16 | U3.22 23.86,9.96 v23.66,10.16
  Bottom 0.305: v3.57,10.24 3.88,9.93 U2.5 3.88,7.8 3.6,7.51 3.25,7.17 3.25,5.24 2.94,4.92 2.94,2.94 J2.12
  Bottom 0.406: Q3.1 25.73,14.33 v25.76,14.36
+5V  (via drill 0.15, 0.15 pad 0.26)
  Top 0.152: 13.18,9.07 v13.18,9.05 v12.78,9.05 | v11.51,16.91 D8.2 | v9.32,16.97 9.32,16.95 D9.2 | v7.87,15.24 7.6,14.96 7.6,14.84 | v7.87,14.92 7.84,14.96 7.84,15.08
  Top 0.305: v17.14,13.34 16.93,13.55 D14.2
  Top 0.406: 28.28,17.03 27.83,17.48 26.24,17.48 | D0.2 28.28,17.03 | 11.48,17.48 9.98,17.48 D9.2 | 11.48,17.48 12,17.48 | 12,17.48 13.54,17.48 | 13.54,17.48 15.61,17.48 | 15.61,17.48 17.83,17.48 | 17.83,17.48 19.89,17.48 | 19.89,17.48 21.95,17.48 | 21.95,17.48 24.18,17.48 | 24.18,17.48 26.24,17.48 | D1.2 26.18,17.43 26.24,17.48 | D2.2 24.08,17.39 24.18,17.48 | D3.2 21.98,17.46 21.95,17.48 | D4.2 19.88,17.48 19.89,17.48 | D5.2 17.78,17.44 17.83,17.48 | 15.61,17.48 15.68,17.41 D6.2 15.72,16.85 v15.72,16.67 | D7.2 13.58,17.45 13.54,17.48 | D8.2 11.48,17.48 | D20.2 28.28,12.9 27.83,13.35 27.35,13.35 | D10.2 8.53,13.76 8.94,13.35 9.26,13.35 | 27.35,13.35 26.08,13.35 | 26.08,13.35 25.29,13.35 | 25.29,13.35 24.02,13.35 | 24.02,13.35 23.23,13.35 | 23.23,13.35 21.95,13.35 | 21.95,13.35 21.16,13.35 | 21.16,13.35 19.89,13.35 | 19.89,13.35 18.94,13.35 | 18.94,13.35 17.83,13.35 | 12.75,13.35 13.54,13.35 13.58,13.31 | 12.75,13.35 11.48,13.35 | 11.48,13.35 10.68,13.35 | 10.68,13.35 9.26,13.35 | D19.2 27.43,13.43 27.35,13.35 | D18.2 25.33,13.4 25.29,13.35 | D17.2 23.23,13.36 23.23,13.35 | D16.2 21.13,13.38 21.16,13.35 | D15.2 19.03,13.45 18.94,13.35 | D12.2 12.73,13.37 12.75,13.35 | D11.2 10.63,13.41 10.68,13.35 | D29.2 9.38,13.23 9.26,13.35 | D28.2 11.48,13.35 | D27.2 13.58,13.31 | D25.2 17.78,13.31 17.83,13.35 | D24.2 19.88,13.34 19.89,13.35 | D23.2 21.98,13.33 21.95,13.35 | D22.2 24.08,13.29 24.02,13.35 | D21.2 26.18,13.26 26.08,13.35 | 25.29,9.07 26.24,9.07 | 26.24,9.07 27.35,9.07 | 27.35,9.07 27.8,9.07 28.28,8.59 D40.2 | D39.2 27.43,9.15 27.35,9.07 | D41.2 26.18,9.01 26.24,9.07 | D38.2 25.33,9.11 25.29,9.07 | D30.2 8.53,9.32 8.78,9.07 9.41,9.07 | 25.29,9.07 24.18,9.07
  Top 0.406: 24.18,9.07 23.23,9.07 | 23.23,9.07 21.95,9.07 | 21.95,9.07 21.16,9.07 | 21.16,9.07 19.89,9.07 | 19.89,9.07 19.1,9.07 | 19.1,9.07 17.83,9.07 | 17.83,9.07 16.88,9.07 | 16.88,9.07 15.76,9.07 | 15.76,9.07 14.81,9.07 | 14.81,9.07 13.7,9.07 | 13.7,9.07 13.18,9.07 12.75,9.07 | 12.75,9.07 11.48,9.07 | 11.48,9.07 10.68,9.07 | 10.68,9.07 9.41,9.07 | D49.2 9.38,9.04 9.41,9.07 | D48.2 11.48,9.07 | D31.2 10.63,9.12 10.68,9.07 | D32.2 12.73,9.09 12.75,9.07 | D47.2 13.58,8.95 13.7,9.07 | D33.2 14.83,9.09 14.81,9.07 | D46.2 15.68,8.99 15.76,9.07 | D34.2 16.93,9.13 16.88,9.07 | D45.2 17.78,9.03 17.83,9.07 | D44.2 19.88,9.06 19.89,9.07 | D35.2 19.03,9.14 19.1,9.07 | D36.2 21.13,9.1 21.16,9.07 | D43.2 21.98,9.04 21.95,9.07 | D42.2 24.08,8.97 24.18,9.07 | D37.2 23.23,9.08 23.23,9.07 | D60.2 28.28,4.44 27.77,4.95 27.35,4.95 | D50.2 8.53,5.35 8.93,4.95 9.26,4.95 | 27.35,4.95 26.24,4.95 | 26.24,4.95 25.29,4.95 | 25.29,4.95 24.18,4.95 | 24.18,4.95 23.23,4.95 | 23.23,4.95 21.95,4.95 | 21.95,4.95 21.16,4.95 | 21.16,4.95 19.89,4.95 | 19.89,4.95 18.94,4.95 | 18.94,4.95 17.83,4.95 | 17.83,4.95 16.88,4.95 | 16.88,4.95 15.76,4.95 | 15.76,4.95 14.81,4.95 | 14.81,4.95 13.54,4.95 | 13.54,4.95 12.75,4.95 | 12.75,4.95 11.48,4.95 | 11.48,4.95 10.53,4.95 | 10.53,4.95 9.26,4.95 | D59.2 27.43,5.03 27.35,4.95 | D58.2 25.33,5 25.29,4.95 | D61.2 26.18,4.89 26.24,4.95 | D62.2 24.08,4.86 24.18,4.95 | D57.2 23.23,4.96 23.23,4.95 | D63.2 21.98,4.93 21.95,4.95 | D56.2 21.13,4.98 21.16,4.95 | D64.2 19.88,4.94 19.89,4.95 | D55.2 19.03,5.05 18.94,4.95 | D65.2 17.78,4.91 17.83,4.95 | D54.2 16.93,5.01 16.88,4.95 | D66.2 15.68,4.87 15.76,4.95 | D53.2 14.83,4.97 14.81,4.95 | D52.2 12.73,4.97 12.75,4.95 | D67.2 13.58,4.91 13.54,4.95
  Top 0.406: D51.2 10.63,5.06 10.53,4.95 | D68.2 11.48,4.95 | D69.2 9.38,4.83 9.26,4.95 | v29.05,2.86 29.53,3.33 v29.53,9.68 29.53,12.54 30,13.02 30,16.19 v29.53,16.67 v28.57,17.62 28.28,17.33 28.28,17.03 | 7.3,12.54 7.35,12.49 7.35,9.73 | 13.58,13.31 13.6,13.34 v13.97,13.34 14.76,13.34 | 14.76,13.34 15.24,13.34 15.68,12.89 D26.2 | D13.2 14.83,13.4 14.76,13.34 | 17.83,13.35 17.16,13.35 v17.14,13.34 | v12,17.22 12,17.48 | USBC.A4/B9 5.15,12.56 4.41,11.83 4.41,11.61 4.03,11.22 2.53,11.22 v1.69,12.06
  Top 0.61: D50.2 8.28,5.54 7.3,6.51 7.3,7.78 | 7.3,13.97 7.3,12.54 7.28,12.56 USBC.A4/B9 | 7.3,7.78 7.3,9.68 7.35,9.73 D30.2 | USBC.B4/A9 7.28,7.76 7.3,7.78 | D10.2 7.34,13.94 7.3,13.97 | 7.3,13.97 7.3,14.54 7.6,14.84 7.84,15.08
  Route2 0.152: v9.63,17.07 9.54,16.97 v9.32,16.97
  Route2 0.61: v13.97,13.34 14.92,12.38 16.19,12.38 v17.14,13.34
  Route2 0.813: v7.87,15.24 9.19,15.24 9.79,15.84 9.79,16.49 v9.32,16.97
  Bottom 0.406: U2.1 2.38,9.21 2.7,9.53 2.7,10.79 2.38,11.11 U2.3 1.69,11.29 v1.69,12.06 C33.2 | R9.2 28.44,17.62 v28.57,17.62 | R18.1 12.97,8.98 13.01,8.98 13.08,9.05 v13.18,9.05 | L2.1 15.44,16.4 v15.72,16.67 | C11.2 11.41,16.8 v11.51,16.91 11.68,16.91 v12,17.22
  Bottom 0.61: v29.53,16.67 C5.1 | v29.05,2.86 29.53,3.33 C3.1 | C6.1 v29.53,9.68 C4.1 | J3.3 8.18,17.22 10.72,17.22 11.41,16.53 C11.2
+12V  (via drill 0.15 pad 0.26)
  Route2 0.813: J3.1 2.84,17.48 v2.84,11.99
  Bottom 0.406: R14.1 6.53,11.43 5.48,11.43 4.92,11.99 v2.84,11.99
  pour Bottom (no thermals): 8.26,11.11 8.26,12.14 8.02,12.38 7.78,12.62 6.99,12.62 6.67,12.62 6.51,12.46 6.51,11.83 6.51,10.95 6.59,10.87 8.02,10.87
D+_P  (via drill 0.15 pad 0.26)
  Top 0.152: USBC.A6 5.01,10.41 4.75,10.14 v4.75,10 4.75,9.7 5.04,9.41 USBC.B6 | v7.99,3.74 7.99,3.19 7.33,2.54 5.56,2.54 4.92,3.17 4.92,4.33 v5.21,4.62
  Bottom 0.152: R6.1 14.45,5.08 13.79,4.42 9.59,4.42 9.13,3.96 8.2,3.96 v7.99,3.74 | v4.75,10 5.06,9.68 5.06,7.8 5.56,7.3 5.56,7.16 6.52,6.2 6.52,5.41 6.1,4.99 5.57,4.99 v5.21,4.62
D+MCU_P
  Bottom 0.152: R6.2 16.12,9.16 U3.47
D-_N  (via drill 0.15 pad 0.26)
  Top 0.152: USBC.A7 6.58,9.91 6.75,10.08 6.75,10.79 6.63,10.91 USBC.B7 5.74,10.87 v5.16,10.87
  Route2 0.406: v5.16,10.87 5.56,10.87 5.87,10.56 5.87,8.97 6.99,7.86 6.99,6.19 6.74,5.95 6.74,5.16 v6.95,4.95
  Bottom 0.152: R7.1 15.56,4.92 14.75,4.12 9.72,4.12 8.97,3.37 7.79,3.37 7.58,3.58 7.58,4.31 v6.95,4.95
D-MCU_N
  Bottom 0.152: R7.2 16.83,8.76 U3.46
GND  (via drill 0.15, 0.15 pad 0.26)
  Top 0.152: D50.3 9.51,6.51 v10,6.51
  Top 0.305: 16.11,15.42 v16.11,15.4
  Top 0.406: D19.3 28.3,14.81 28.3,14.95 27.83,15.42 27.51,15.42 | 10.53,15.42 11.48,15.42 | 11.48,15.42 12.75,15.42 | 12.75,15.42 13.7,15.42 | 13.7,15.42 14.81,15.42 | 14.81,15.42 15.76,15.42 | 15.76,15.42 16.11,15.42 16.88,15.42 | 16.88,15.42 17.83,15.42 | 17.83,15.42 18.94,15.42 | 18.94,15.42 19.89,15.42 | 19.89,15.42 21.16,15.42 | 21.16,15.42 22.11,15.42 | 22.11,15.42 23.23,15.42 | 23.23,15.42 24.18,15.42 | 24.18,15.42 25.29,15.42 | 25.29,15.42 26.24,15.42 | 26.24,15.42 27.51,15.42 | D0.3 27.43,15.5 27.51,15.42 | D1.3 25.33,15.46 25.29,15.42 | D18.3 26.18,15.36 26.24,15.42 | D2.3 23.23,15.43 23.23,15.42 | D17.3 24.08,15.32 24.18,15.42 | D3.3 21.13,15.45 21.16,15.42 | D16.3 21.98,15.29 22.11,15.42 | D4.3 19.03,15.51 18.94,15.42 | D15.3 19.88,15.41 19.89,15.42 | D5.3 16.93,15.48 16.88,15.42 | D14.3 17.78,15.38 17.83,15.42 | D6.3 14.83,15.44 14.81,15.42 | D13.3 15.68,15.34 15.76,15.42 | D7.3 12.75,16.02 12.75,15.42 | D12.3 13.58,15.3 13.7,15.42 | D8.3 10.63,15.53 10.53,15.42 | D11.3 11.48,15.42 | 10.53,15.42 9.41,15.42 | 9.41,15.42 9,15.42 8.53,15.89 D9.3 | D10.3 9.38,15.39 9.41,15.42 | D29.3 8.53,11.7 8.98,11.25 9.41,11.25 | 9.41,11.25 10.68,11.25 | 10.68,11.25 11.48,11.25 | 11.48,11.25 12.75,11.25 | 12.75,11.25 13.54,11.25 | 13.54,11.25 14.81,11.25 | 14.81,11.25 15.61,11.25 | 15.61,11.25 16.88,11.25 | 16.88,11.25 17.83,11.25 | 18.94,11.25 19.89,11.25 | 19.89,11.25 21.16,11.25 | 21.16,11.25 21.95,11.25 21.98,11.23 | 24.18,11.25 25.29,11.25 | 25.29,11.25 26.08,11.25 | 26.08,11.25 27.35,11.25 | 27.35,11.25 27.71,11.25 28.28,10.69 D39.3 | D20.3 27.43,11.33 27.35,11.25 | D21.3 25.33,11.3 25.29,11.25 | D23.3 21.13,11.28 21.16,11.25 | D24.3 19.03,11.35 18.94,11.25
  Top 0.406: D25.3 16.93,11.31 16.88,11.25 | D26.3 14.83,11.27 14.81,11.25 | D27.3 12.73,11.27 12.75,11.25 | D28.3 10.63,11.31 10.68,11.25 | D30.3 9.38,11.22 9.41,11.25 | D31.3 11.48,11.25 | D32.3 13.58,11.21 13.54,11.25 | D33.3 15.68,11.18 15.61,11.25 | D34.3 17.78,11.21 17.83,11.25 | D35.3 19.88,11.24 19.89,11.25 | D36.3 21.98,11.23 | D37.3 24.08,11.16 24.18,11.25 | D38.3 26.18,11.16 26.08,11.25 | 28.28,6.49 D59.3 | 28.28,6.49 27.71,7.05 27.35,7.05 | 27.35,7.05 26.24,7.05 | 26.24,7.05 25.29,7.05 | 25.29,7.05 24.02,7.05 | 24.02,7.05 23.23,7.05 | 23.23,7.05 21.95,7.05 | 21.95,7.05 21.16,7.05 | 21.16,7.05 19.89,7.05 | 19.89,7.05 18.94,7.05 | 18.94,7.05 17.67,7.05 | 17.67,7.05 16.88,7.05 | 16.88,7.05 16.35,7.05 | 16.35,7.05 15.61,7.05 | 15.61,7.05 14.81,7.05 | 14.81,7.05 13.54,7.05 | 13.54,7.05 12.75,7.05 | 12.75,7.05 11.48,7.05 | 11.48,7.05 10.68,7.05 | 10.68,7.05 9.41,7.05 | 9.41,7.05 9.01,7.05 | D49.3 8.53,7.53 9.01,7.05 | D60.3 26.72,2.72 25.29,2.72 | D69.3 8.53,2.97 8.78,2.72 10.68,2.72 | 25.29,2.72 23.23,2.72 | 23.23,2.72 21.16,2.72 | 21.16,2.72 19.1,2.72 | 19.1,2.72 16.88,2.72 | 16.88,2.72 14.81,2.72 | 14.81,2.72 12.75,2.72 | 12.75,2.72 10.68,2.72 | 10.68,2.72 10.63,2.77 D68.3 10.43,3.44 10.37,3.38 10.19,3.38 v10.06,3.25 | D67.3 12.73,2.74 12.75,2.72 | D66.3 14.83,2.74 14.81,2.72 | D65.3 16.93,2.78 16.88,2.72 | D64.3 19.03,2.79 19.1,2.72 | D63.3 21.13,2.75 21.16,2.72 | D62.3 23.23,2.73 23.23,2.72 | D61.3 25.33,2.76 25.29,2.72 | D48.3 10.63,7.11 10.68,7.05 | D51.3 11.48,7.05 | D50.3 9.38,7.02 9.41,7.05 | D52.3 13.58,7.01 13.54,7.05 | D47.3 12.73,7.07 12.75,7.05 | D46.3 14.83,7.07 14.81,7.05 | D53.3 15.68,6.98 15.61,7.05 | D45.3 16.93,7.11 16.88,7.05 | D54.3 17.78,6.94 17.67,7.05
  Top 0.406: D44.3 19.03,7.15 18.94,7.05 | D55.3 19.88,7.04 19.89,7.05 | D43.3 21.13,7.08 21.16,7.05 | D56.3 21.98,7.03 21.95,7.05 | D42.3 23.23,7.06 23.23,7.05 | D57.3 24.08,6.99 24.02,7.05 | D41.3 25.33,7.1 25.29,7.05 | D58.3 26.18,6.99 26.24,7.05 | D40.3 27.43,7.13 27.35,7.05 | D22.3 23.39,11.68 23.39,11.38 v23.5,11.27 | v23.5,11.27 23.69,11.27 23.71,11.25 24.18,11.25 | 21.98,11.23 23.45,11.23 v23.5,11.27 | v6.35,6.99 6.64,6.69 6.64,5.98 v7.22,5.4 | 17.83,11.25 18.2,11.25 18.22,11.28 18.61,11.28 18.64,11.25 18.94,11.25 | v16.35,6.99 16.35,7.05 | v28.73,6.35 28.42,6.35 28.28,6.49 | 27.35,11.25 27.3,11.3 v27.3,11.59 | v1.75,16.51 1.59,16.67 S1.1 | v8.5,6.99 8.94,6.99 9.01,7.05
  Top 0.61: USBC.B1/A12 6.33,6.96 v6.35,6.99 | USBC.A1/B12 v5.88,13.36 v5.89,13.37
  Bottom 0.152: C12.1 10.53,6.51 v10,6.51 10,5.34 C13.1 | C9.2 14.39,8.49 v14.21,8.49 | R15.2 6.8,9.07 v6.67,9.21 | R19.2 8,6.49 v8.5,6.99
  Bottom 0.305: IC1.4 16.19,13.42 v16.19,13.34
  Bottom 0.406: C6.2 29.22,6.35 v28.73,6.35 | C10.1 26.99,11.91 v27.3,11.59 | U3.57 21.43,10.64 v21.91,10.64
  other vias: 0.64,10.16 29.21,14.92 13.65,10.79 8.73,16.03 27.62,7.78 9.37,10.56 10.95,11.27 10,10.59 10.11,9.57 12.08,12.65 13.57,11.24 20.49,11.26 13.13,7.05 21.13,3.25 23.24,3.41 25.34,3.38 25.77,11.26
  pour Top (rank 2): 0,0 30.48,0 30.48,20.32 0,20.32
  pour Bottom (rank 2): 0,0 30.48,0 30.48,20.32 0,20.32
  pour Bottom: 23.5,10.95 24.92,10.95 25.08,11.11 25.08,11.27 24.92,11.43 23.81,11.43 23.5,11.75 23.34,11.75 23.18,11.59 23.18,11.27 23.18,11.11 23.34,10.95
  pour Route2 (rank 2): 0,0 30.48,0 30.48,20.32 0,20.32
  pour Route15 (rank 2): 0,0 30.48,0 30.48,20.32 0,20.32
GP0(RXI)
  Bottom 0.152: U3.2 18.75,16.49 18.41,16.83 17.35,16.83 17.03,17.14 14.81,17.14 14.49,17.46 12.54,17.46 12.14,17.86 10.08,17.86 J3.4
GP1(TXO)
  Bottom 0.152: U3.3 19.16,16.88 18.89,17.14 17.46,17.14 17.14,17.46 14.92,17.46 14.61,17.78 12.7,17.78 J3.5
GP2
  Bottom 0.152: U3.4 19.55,16.96 19.05,17.46 17.62,17.46 17.3,17.78 15.24,17.78 J3.6
GP3
  Bottom 0.152: U3.5 19.95,17.03 19.21,17.78 17.78,17.78 J3.7
GP4
  Bottom 0.152: U3.6 20.36,17.75 J3.8
GP5
  Bottom 0.152: U3.7 20.75,16.95 21.59,17.78 J3.9
GP6
  Bottom 0.152: U3.8 21.16,16.71 22.23,17.78 22.86,17.78 J3.10
GP7
  Bottom 0.152: U3.9 21.55,16.63 22.38,17.46 23.02,17.46 23.34,17.78 25.4,17.78 J3.11
GP8
  Bottom 0.152: U3.11 22.36,16.8 22.71,17.16 23.14,17.16 23.46,17.48 25.53,17.48 25.77,17.72 27.88,17.72 J3.12
GP16
  Bottom 0.152: U3.27 25.06,7.96 25.24,7.78 25.24,4.13 26.67,2.7 27.78,2.7 J2.1
GP17
  Bottom 0.152: U3.28 24.36,4.68 24.36,3.58 J2.2
GP18
  Bottom 0.152: J2.3 24.13,3.25 23.55,3.83 U3.29
GP19
  Bottom 0.152: U3.30 23.16,4 22.42,3.26 22.42,2.1 J2.4
GP20
  Bottom 0.152: U3.31 22.75,4.18 21.11,2.54 20.32,2.54 J2.5
GP21
  Bottom 0.152: U3.32 22.36,4.26 21.91,3.81 20.32,3.81 19.37,2.86 18.1,2.86 J2.6
GP25
  Bottom 0.152: U3.37 20.36,4.28 19.25,3.17 17.46,3.17 17.14,2.86 15.88,2.86 15.56,2.54 15.24,2.54 J2.7
GP26
  Bottom 0.152: U3.38 19.95,4.4 19.05,3.49 17.3,3.49 16.99,3.17 15.72,3.17 15.39,2.85 15.11,2.85 14.81,2.54 12.7,2.54 J2.8
GP27
  Bottom 0.152: U3.39 19.55,4.43 18.94,3.81 17.14,3.81 16.83,3.49 15.56,3.49 15.21,3.15 14.99,3.15 14.68,2.85 12.57,2.85 12.27,2.54 10.76,2.54 10.41,2.18 9.8,2.18 J2.9
GP28
  Bottom 0.152: U3.40 19.16,4.55 18.73,4.13 16.99,4.13 16.67,3.81 15.4,3.81 15.04,3.45 14.86,3.45 14.56,3.15 12.45,3.15 12.14,2.85 10.64,2.85 10.33,2.54 7.62,2.54 J2.10
GP29
  Bottom 0.152: U3.41 18.75,4.63 18.57,4.45 16.83,4.45 16.5,4.12 15.23,4.12 14.87,3.76 14.73,3.76 14.43,3.45 12.32,3.45 12.02,3.15 10.49,3.15 10.19,2.85 7.49,2.85 7.19,2.54 5.08,2.54 J2.11
LED_OUT
  Top 0.152: J1.1 7.13,4.59 8.23,4.59 D69.1
LEDS  (via drill 0.15 pad 0.26)
  Route2 0.406: v21.56,5.96 22.75,4.76 28.73,4.76 29.37,5.4 29.37,8.89 28.26,10 28.26,14.29 25.72,16.83 v24.61,16.83
  Bottom 0.152: R8.1 26.96,14.31 26.83,14.45 26.83,15.08 25.91,16 | 25.91,16 Q3.2 | v24.61,16.83 24.92,16.51 25.4,16.51 25.91,16 | U3.34 v21.56,5.96
N$1
  Top 0.203: D0.1 26.58,16.04 D1.4
N$2
  Top 0.203: D1.1 24.48,16.04 D2.4
N$3
  Top 0.203: D2.1 22.38,16.04 D3.4
N$4
  Top 0.203: D3.1 20.28,16.04 D4.4
N$5
  Top 0.203: D4.1 18.18,16.04 D5.4
N$6
  Top 0.203: D5.1 16.08,16.04 D6.4
N$7
  Top 0.203: D6.1 13.98,16.04 D7.4
N$8
  Top 0.203: D7.1 11.88,16.04 D8.4
N$9
  Top 0.203: D8.1 9.78,16.04 D9.4
N$10
  Top 0.203: D9.1 7.99,16.34 7.99,15.76 8.53,15.21 D10.4
N$11
  Top 0.203: D11.4 9.78,13.94 D10.1
N$12
  Top 0.203: D12.4 11.88,13.94 D11.1
N$13
  Top 0.203: D13.4 13.98,13.94 D12.1
N$14
  Top 0.203: D14.4 16.08,13.94 D13.1
N$15
  Top 0.203: D15.4 18.18,13.94 D14.1
N$16
  Top 0.203: D16.4 20.28,13.94 D15.1
N$17
  Top 0.203: D17.4 22.38,13.94 D16.1
N$18
  Top 0.203: D18.4 24.48,13.94 D17.1
N$19
  Top 0.203: D19.4 26.58,13.94 D18.1
N$20
  Top 0.203: D19.1 28.76,13.46 28.76,12.31 D20.4
N$21
  Top 0.203: D20.1 26.58,11.84 D21.4
N$22
  Top 0.203: D21.1 24.48,11.84 D22.4
N$23
  Top 0.203: D22.1 22.38,11.84 D23.4
N$24
  Top 0.203: D23.1 20.28,11.84 D24.4
N$25
  Top 0.203: D24.1 18.18,11.84 D25.4
N$26
  Top 0.203: D25.1 16.08,11.84 D26.4
N$27
  Top 0.203: D26.1 13.98,11.84 D27.4
N$28
  Top 0.203: D27.1 11.88,11.84 D28.4
N$29
  Top 0.203: D28.1 9.78,11.84 D29.4
N$30
  Top 0.203: D29.1 7.99,12.14 7.99,11.11 8.51,10.59 D30.4
N$31
  Top 0.203: D31.4 10.57,10.59 9.72,9.73 D30.1
N$32
  Top 0.203: D32.4 11.88,9.73 D31.1
N$33
  Top 0.203: D33.4 13.98,9.73 D32.1
N$34
  Top 0.203: D34.4 16.08,9.73 D33.1
N$35
  Top 0.152: D35.4 19.03,10.51 18.58,10.05 18.58,9.84 18.47,9.73 D34.1
N$36
  Top 0.203: D36.4 20.28,9.73 D35.1
N$37
  Top 0.203: D37.4 22.38,9.73 D36.1
N$38
  Top 0.203: D38.4 24.48,9.73 D37.1
N$39
  Top 0.203: D39.4 26.58,9.73 D38.1
N$40
  Top 0.203: D39.1 28.76,9.26 28.76,8.11 D40.4
N$41
  Top 0.203: D40.1 26.58,7.63 D41.4
N$42
  Top 0.203: D41.1 24.48,7.63 D42.4
N$43
  Top 0.203: D42.1 22.38,7.63 D43.4
N$44
  Top 0.203: D43.1 20.28,7.63 D44.4
N$45
  Top 0.203: D44.1 18.18,7.63 D45.4
N$46
  Top 0.203: D45.1 16.08,7.63 D46.4
N$47
  Top 0.203: D46.1 13.98,7.63 D47.4
N$48
  Top 0.203: D47.1 11.88,7.63 D48.4
N$49
  Top 0.203: D48.1 9.78,7.63 D49.4
N$50
  Top 0.203: D49.1 7.99,7.94 7.99,6.77 8.21,6.54 8.37,6.54 D50.4
N$51
  Top 0.203: D51.4 9.78,5.54 D50.1
N$52
  Top 0.203: D52.4 11.88,5.54 D51.1
N$53
  Top 0.203: D53.4 13.98,5.54 D52.1
N$54
  Top 0.203: D54.4 16.08,5.54 D53.1
N$55
  Top 0.203: D55.4 18.18,5.54 D54.1
N$56
  Top 0.203: D56.4 20.28,5.54 D55.1
N$57
  Top 0.203: D57.4 22.38,5.54 D56.1
N$58
  Top 0.203: D58.4 24.48,5.54 D57.1
N$59
  Top 0.203: D59.4 26.58,5.54 D58.1
N$60
  Top 0.203: D59.1 28.76,5.06 28.76,3.91 D60.4
N$61
  Top 0.203: D60.1 26.58,3.44 D61.4
N$62
  Top 0.203: D61.1 24.48,3.44 D62.4
N$63
  Top 0.203: D62.1 22.38,3.44 D63.4
N$64
  Top 0.203: D63.1 20.28,3.44 D64.4
N$65
  Top 0.203: D64.1 18.18,3.44 D65.4
N$66
  Top 0.203: D65.1 16.08,3.44 D66.4
N$67
  Top 0.203: D66.1 13.98,3.44 D67.4
N$68
  Top 0.203: D67.1 11.88,3.44 D68.4
N$69
  Top 0.203: D68.1 10.18,3.83 9.78,3.83 D69.4
N$70
  Bottom 0.152: R3.1 26.35,6.67 25.86,7.16 25.86,8.06 25.24,8.69 25.24,10 24.88,10.36 U3.21
N$71  (via drill 0.15 pad 0.26)
  Top 0.406: S1.2 3.86,16.45 v3.86,15.16
  Route2 0.406: v16.27,16.78 16.27,16.27 16.03,16.03 11.73,16.03 10.06,14.37 7.21,14.37 6.54,13.7 6.54,12.72 6.08,12.26 4.27,12.26 3.7,12.83 3.7,15 v3.86,15.16
  Bottom 0.152: R4.2 16.27,16.3 v16.27,16.78
N$79
  Bottom 0.152: C1.1 8.93,7.6 8.93,7.61 8.71,7.83 U1.9
N$80
  Bottom 0.813: L3.1 L1.2
N$81
  Bottom 0.813: L1.1 13.29,15.07 L2.2
N$82
  Bottom 0.152: R1.2 11.75,6.09 C13.2
N$83
  Bottom 0.152: R1.1 C12.2 10.72,7.34 9.71,8.35 U1.7
N$84
  Bottom 0.152: U1.8 9.21,8.35 9.6,7.96 9.6,6.11 8.89,5.39 8.89,4.92 8.48,4.51 7.91,4.51 7.62,4.79 7.62,5.71 7.06,6.27 7.06,7.83 R15.1 6.69,8.07 6.11,8.65 6.11,9.42 R14.2
N$85
  Bottom 0.152: R16.1 R18.2
N$86
  Bottom 0.152: U1.10 8.21,7.75 R19.1
PH  (via drill 0.15 pad 0.26)
  Route2 0.813: v8.1,4.97 8.1,5.61 9.18,6.7 9.18,8.83 8,10.02 v8,12.86
  Bottom 0.406: C1.2 9.05,6.27 8.1,5.32 v8.1,4.97 | U1.2 8.71,12.17 8.02,12.86 v8,12.86 7.94,12.86 7.26,13.54 L3.2
QSPI_CS  (via drill 0.15 pad 0.26)
  Route2 0.305: v16.35,14.92 14.21,14.92 13.16,13.87 v13.16,12.26
  Bottom 0.152: U3.56 17.55,14.67 R32.1 R4.1 16.38,14.9 v16.35,14.92 | IC1.1 14.49,13.86 14.38,13.97 13.57,13.97 13.16,13.55 v13.16,12.26
QSPI_DATA[0]
  Bottom 0.152: U3.53 16.16,11.56 15.99,11.39 IC1.5
QSPI_DATA[1]
  Bottom 0.152: IC1.2 14.99,14.2 15.16,14.37 16.43,14.37 16.67,14.13 16.67,12.7 17.01,12.36 U3.55
QSPI_DATA[2]
  Bottom 0.152: IC1.3 15.49,12.93 15.72,12.7 16.19,12.7 16.93,11.96 U3.54
QSPI_DATA[3]
  Bottom 0.152: U3.51 16.95,10.76 16.83,10.64 16.83,10.21 16.46,9.84 15.29,9.84 14.99,10.14 IC1.7
QSPI_SCK
  Bottom 0.152: IC1.6 15.49,10.23 15.57,10.14 16.34,10.14 16.51,10.32 16.51,10.79 16.88,11.16 U3.52
RESET  (via drill 0.15 pad 0.26)
  Top 0.203: S2.2 2.38,3.65 v2.06,3.97
  Route2 0.254: v2.06,3.97 3.19,2.84 4.46,2.84 4.78,2.52 7.84,2.52 8.16,2.84 28.19,2.84 v28.26,2.78
  Bottom 0.152: U3.26 25.14,8.36 25.56,7.94 25.56,5.87 25.88,5.56 R5.1 27.3,5.21 27.3,3.73 v28.26,2.78
VSENSE
  Bottom 0.152: U1.6 10.21,8.45 10.72,7.94 13.57,7.94 13.73,8.1 13.73,9.37 13.41,9.68 R16.2 R17.1
X+_P
  Bottom 0.152: U3.20 25.12,10.76 25.56,10.32 25.56,9.98 Y2.3 26.96,8.57 C8.2
X-_N
  Bottom 0.152: R3.2 28.57,7.28 28.57,9.84 27.86,10.56 | Y2.1 27.77,10.65 27.86,10.56 | C10.2 27.96,10.66 27.86,10.56

### Text on the board
bTest: www.vcclabs.com
tDocu: BOOT | RST